# Altium project SingleChip-Rev2.PrjPcb (part 8 of 8)

## Sheet FAKRA connector.SchDoc: =ProjectTitle
size A3; Author: Jaime I. Chait; Organization: NWES LLC; Address1: 111 SW 5th Ave, STE 3150; Address2: Portland, OR 97204; DocumentNumber: SCH-0001; Revision: 2; SheetNumber: 17; SheetTotal: 19
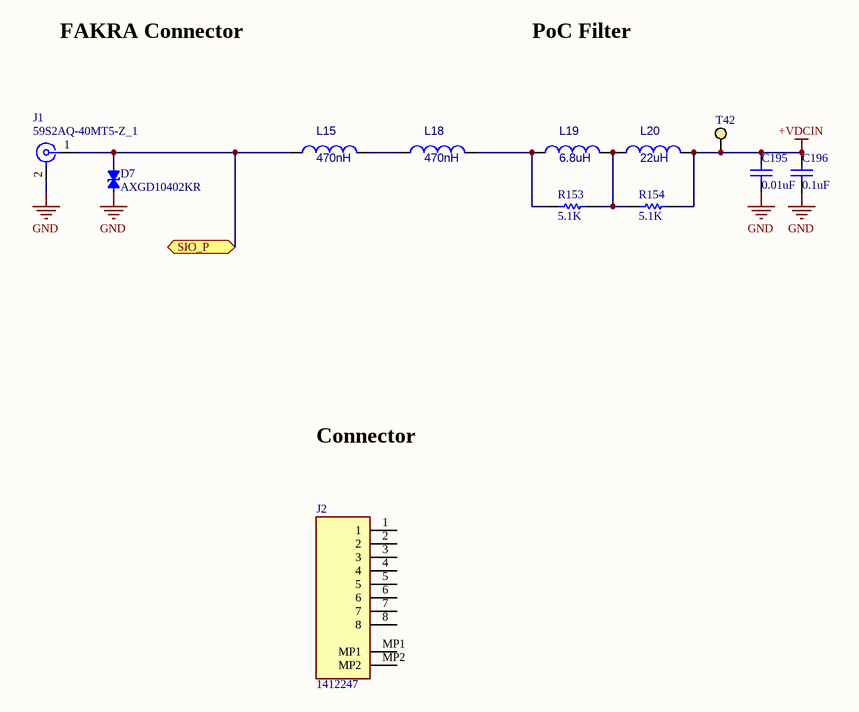
[diagram p19: FAKRA connector.SchDoc]

### Parts
C195  0.01uF  [CAPC1005X55USR]
C196  0.1uF  [CAPC1005X55USR]
D7  AXGD10402KR  [D_0402_1005Metric]
J1  59S2AQ-40MT5-Z_1  [Conn_FAKRA_59S2AQ-40MT5-Z_1]
J2  1412247  [CONN_Phoenix Contact_1412247]
L15  470nH  [PFL1609471MEW]
L18  470nH  [PFL1609471MEW]
L19  6.8uH  [IND_1210POC]
L20  22uH  [IND_MSS6132T]
R153  5.1K  [RESC1005X40USR]
R154  5.1K  [RESC1005X40USR]
T42  TP_S  [TP 1mm]  (value not drawn)  (no BOM)

### Ports
SIO_P (bidir)

### Nets
+VDCIN: C195.2 C196.1 L20.2 R154.2 T42.1
GND: C195.1 C196.2 D7.2(A) J1.2
NetC188_1: D7.1(C) J1.1 L15.1 ; port SIO_P
NetL15_2: L15.2 L18.1
NetL18_2: L18.2 L19.1 R153.1
NetL19_2: L19.2 L20.1 R153.2 R154.1

Not connected (* = marked no-connect by the designer): J1 3 4 5; J2 1 2 3 4 5 6 7 8 MP1 MP2

### Notes on the sheet
- FAKRA Connector
- PoC Filter
- Connector
- Title
- Size:
- Date:
- A4
- Number:
- Time:
- Revision:
- Sheet
- of
- File:

### Library data of the parts
C195 = CAP CER 0.01uF 50V X7R 0402: CAP CER 10000PF 50V X7R 0402; Manufacturer Part Number: GCM155R71H103KA55D; Manufacturer: Murata Electronics; Supplier Part Number 1: 490-4762-1-ND; Package: 0402; Height: 0.55mm; Supplier 1: Digi-Key; value: 0.01uF
C196 = CAP CER 0.1UF 25V X5R 0402: Manufacturer Part Number: CL05A104KA5NNNC; Manufacturer: Samsung Electro-Mechanics; Supplier Part Number 1: 1276-1043-1-ND; Package: 0402; Height: 0.55mm; Supplier 1: Digi-Key; value: 0.1uF
D7 = DIODE TVS 40VC 0402: ESD Suppressor Diode TVS Bi-Dir 24V Automotive 2-Pin Case 0402(1006Metric) T/R; Manufacturer: Littelfuse; Number of Bidirectional Channels: 1; Power Line Protection: No; Diode Type: ZENER; Supplier 1: Digikey; Supplier Part Number 1: F10019CT-ND; Manufacturer Part Number: AXGD10402KR; RoHS: Yes; Category: TVS Diodes; Stock: 44275; Pricing: 1=0.49, 10=0.356, 100=0.242, 500=0.19, 1000=0.152, 2000=0.146, 5000=0.14 (USD); Mounting Technology: Surface Mount; Case/Package: 0402; Case Code (Imperial): 0402; Case Code (Metric): 1005; Min Operating Temperature: -65°C; Max Operating Temperature: 125°C; Packaging: Cut Tape; Series: Automotive, AEC-Q200, XTREME-GUARD™; RoHS Compliant: Yes; ComponentLink1URL: https://media.digikey.com/pdf/Data%20Sheets/Littelfuse%20PDFs/AXGD1_Series.pdf?src-supplier=Digikey; ComponentLink1Description: https://media.digikey.com/pdf/Data%20Sheets/Littelfuse%20PDFs/AXGD1_Series.pdf?src-supplier=Digikey; ComponentLink2URL: https://datasheet.octopart.com/AXGD10402KR-Littelfuse-datasheet-102879905.pdf?src-supplier=Element14; ComponentLink2Description: https://datasheet.octopart.com/AXGD10402KR-Littelfuse-datasheet-102879905.pdf?src-supplier=Element14; ComponentLink3URL: https://datasheet.octopart.com/AXGD10402KR-Littelfuse-datasheet-170671804.pdf?src-supplier=Future+Electronics; ComponentLink3Description: https://datasheet.octopart.com/AXGD10402KR-Littelfuse-datasheet-170671804.pdf?src-supplier=Future+Electronics
J1 = Conn_FAKRA_59S2AQ-40MT5-Z_1: Right Angle Plug Pcb W/housin; Manufacturer: Rosenberger; Supplier 1: Mouser; Supplier Part Number 1: 476-59S2AQ-40MT5-Z_1; Manufacturer Part Number: 59S2AQ-40MT5-Z_1; RoHS: Yes; Category: RF / Coaxial Connectors; Stock: 5980; Pricing: 1=2.6, 10=2.37, 50=2.37, 100=2.09, 1000=1.5, 10000=1.35 (USD); RoHS Compliant: Yes
J2 = CONN_1412247: Circular connector; Insert; Female Sockets; 8 position; M8-8; 30V; Manufacturer: Phoenix Contact; Number of Positions: 8; Ratings: IP67,Waterproof,Dust Tight; Supplier 1: Digikey; Supplier Part Number 1: 277-10264-2-ND; Manufacturer Part Number: 1412247; RoHS: Yes; Category: Circular Connectors; Pricing: 100=9.09 (USD); Mounting Technology: Surface Mount; Pins: 8; Contact Material: Copper; Contact Finish - Mating: GOLD; Min Operating Temperature: -55°C; Max Operating Temperature: 105°C; Packaging: Cut Tape; Series: SACC; Termination: Solder; Voltage Rating (AC): 30V; Flammability Rating: UL94 V-0; ComponentLink1URL: https://media.digikey.com/pdf/Data%20Sheets/Phoenix%20Contact%20PDFs/1412247.pdf?src-supplier=Digikey; ComponentLink1Description: https://media.digikey.com/pdf/Data%20Sheets/Phoenix%20Contact%20PDFs/1412247.pdf?src-supplier=Digikey
L15 L18 = POWER INDUCTOR, SHIELDED, 20% TO: Power inductor, shielded, 20% tol, SMT, RoHS, halogen f; Manufacturer: Coilcraft; Manufacturer Part Number: PFL1609-471MEW; Core Material: Composite; Self Resonant Frequency: 650MHz; Max DC Current: 1.3A; Test Frequency: 7.9MHz; Supplier 1: Mouser; Supplier Part Number 1: 994-PFL1609-471MEW; RoHS: Yes; Category: Fixed Inductors; Stock: 2458; Pricing: 1=0.72, 10=0.72, 50=0.72, 100=0.7, 1000=0.536, 10000=0.515 (USD); Min Operating Temperature: -40°C; Max Operating Temperature: 85°C; Packaging: Tape and Reel; Tolerance: 20%; Shielding: Shielded; Value: 470nH; Termination: SMD/SMT; Series: PFL1609; Length: 1.8mm; Width: 1.07mm; Height: 0.95mm; Lead Free: Contains Lead; RoHS Compliant: Yes; ComponentLink1URL: http://www.mouser.com/ds/2/597/pfl1609-270712.pdf?src-supplier=Mouser; ComponentLink1Description: http://www.mouser.com/ds/2/597/pfl1609-270712.pdf?src-supplier=Mouser
L19 = Power Injection Chokes for PoC: Power Injection Chokes for PoC 6.8uH/1A; Manufacturer: Coilcraft; Manufacturer Part Number: 1210POC-682; RoHS: Yes; Category: Fixed Inductors; RoHS Compliant: Yes; Inductance: 6.8uH
L20 = FIXED IND 22UH 1.9A 158MOHM SM: Power Inductor, shielded, ferrite core, 20% tol, SMT, RoHS; Manufacturer: Coilcraft; Manufacturer Part Number: MSS6132T-223MLC; Supplier 1: Mouser; Supplier Part Number 1: 994-MSS6132T-223MLC; RoHS: Yes; Category: Fixed Inductors; Stock: 1738; Pricing: 1=2.13, 10=2.13, 50=2.13, 100=2.13, 1000=0.854, 10000=0.837 (USD); RoHS Compliant: Yes; ComponentLink1URL: https://datasheet.octopart.com/MSS6132T-223MLC-Coilcraft-datasheet-96966862.pdf?src-supplier=Coilcraft+Direct; ComponentLink1Description: https://datasheet.octopart.com/MSS6132T-223MLC-Coilcraft-datasheet-96966862.pdf?src-supplier=Coilcraft+Direct
R153 R154 = RES 5.1K OHM 1% 1/16W 0402: Manufacturer Part Number: RC0402FR-075K1L; Manufacturer: YAGEO; Supplier Part Number 1: 311-5.10KLRCT-ND; Supplier 1: Digi-Key; Height: 0.4mm; Package: 0402; value: 5.1K
T42 = Test point PAD: test point

## Nets that join several sheets
+0.6V_DDR_VREF: DDR4 (C22.2 U5.M1), Power-2 (C104.2 T18.1 U15.6)
+0.6V_DDR_VTT: DDR4 (38 pins), Power-2 (C102.1 T17.1 U15.3 U15.5)
+0.9V_MGTAVCC: FPGA Config_Power (7 pins), Power-2 (7 pins)
+1.2V_DDR: DDR4 (46 pins), Power-2 (9 pins)
+1.2V_MGTAVTT: FPGA Config_Power (17 pins), Power-2 (7 pins)
+1.8V_MGTAUX: FPGA Config_Power (C171.2 U3.R7 U3.U7), Power-2 (5 pins)
+1.8V_S1: Power-2 (17 pins), Serializer (C182.2 C183.2 C184.2 U4.11)
+1.8V_S2: FPGA-Camera-AWR (10 pins), FPGA Config_Power (27 pins), Power-1 (5 pins)
+2.5V_DDR: DDR4 (C90.2 C92.2 U5.B1 U5.R9), Power-2 (5 pins)
+3.3V: FPGA-Camera-AWR (5 pins), FPGA IO (22 pins), Power-1 (8 pins), Power-2 (15 pins), SFP_10GbE_Port0 (10 pins), Clock-Gen (7 pins), OX05B1S_CAM0 (9 pins), Serializer (13 pins), EVK External Connector (J5.40 R122.1)
+3.3VD: AWR2243_Decoupling_Caps (C5.1), AWR2243_DUT (11 pins), AWR2243_ExPWR_RST_LEDs (R74.2 R90.2 R189.2), AWR2243_LC_Filtering (R133.2)
+5V: AWR2243_ExPWR_RST_LEDs (R100.2 R103.2 R117.2), AWR2243_PMIC (11 pins), Power-1 (6 pins), Power-2 (C110.2 U17.2 U17.3), EVK External Connector (J5.2)
+VDCIN: Power-1 (33 pins), Power-2 (9 pins), FAKRA connector (5 pins)
AR_1P3_RF1: AWR2243_Decoupling_Caps (C45.1 C47.1), AWR2243_DUT (U2.G5 U2.H5 U2.J5), AWR2243_LC_Filtering (C36.2 C38.2 L5.2)
AR_1P3_RF2: AWR2243_Decoupling_Caps (C57.1 C58.1), AWR2243_DUT (U2.C2 U2.D2), AWR2243_LC_Filtering (C33.2 C34.2 L8.2 R137.1)
AR_1V2: AWR2243_Decoupling_Caps (C3.1 C4.1 C6.1 C7.1), AWR2243_DUT (6 pins), AWR2243_LC_Filtering (L9.2)
AR_1V4_APLL: AWR2243_Decoupling_Caps (C13.1), AWR2243_DUT (U2.A10)
AR_1V4_SYNTH: AWR2243_Decoupling_Caps (C14.1), AWR2243_DUT (U2.A13)
AR_1V8: AWR2243_Decoupling_Caps (7 pins), AWR2243_DUT (6 pins), AWR2243_LC_Filtering (C19.1 C91.2 L7.2)
AR_VBGAP: AWR2243_Decoupling_Caps (C56.1), AWR2243_DUT (U2.B10)
AR_VOUT_PA: AWR2243_Decoupling_Caps (C10.1 C65.1 C83.1), AWR2243_DUT (U2.A2 U2.B2), AWR2243_LC_Filtering (R137.2)
GND: AWR2243_Decoupling_Caps (22 pins), AWR2243_DUT (84 pins), AWR2243_ExPWR_RST_LEDs (7 pins), AWR2243_LC_Filtering (6 pins), AWR2243_PMIC (20 pins), DDR4 (50 pins), FPGA-Camera-AWR (19 pins), FPGA Config_Power (233 pins), FPGA IO (15 pins), Power-1 (73 pins), Power-2 (59 pins), SFP_10GbE_Port0 (15 pins), Clock-Gen (8 pins), OX05B1S_CAM0 (80 pins), Serializer (29 pins), EVK External Connector (J5.P1 J5.P2 J5.P3 J5.P4), FAKRA connector (C195.1 C196.2 D7.2 J1.2)
PMIC_1V0: AWR2243_LC_Filtering (L5.1 L8.1), AWR2243_PMIC (C81.2 L4.2 U8.1)
PMIC_1V2: AWR2243_LC_Filtering (L9.1), AWR2243_PMIC (C54.2 L1.2 U8.14)
PMIC_1V8: AWR2243_LC_Filtering (L7.1), AWR2243_PMIC (C82.2 L3.2 U8.21)
PMICOUT_3V3: AWR2243_LC_Filtering (R133.1), AWR2243_PMIC (C55.2 L2.2 R141.1 U8.8)
VCCINT: FPGA Config_Power (49 pins), Power-1 (12 pins)
VIO2: FPGA-Camera-AWR (5 pins), Power-2 (5 pins), EVK External Connector (J5.39)
+1.2V_DDR_PGOOD: Power-2 (R81.1 T19.1 U10.1 U15.7), Clock-Gen (Y2.1)
+1.2V_MGTAVTT_PGOOD: Power-2 (Q10.1 R109.1 T38.1 U19.9), Clock-Gen (Y3.1 Y4.1)
+1.8V_S2_PGOOD: Power-1 (R62.1 T6.1 U11.1), Power-2 (U6.3)
AR_GPIO_2: AWR2243_DUT (U2.N13), AWR2243_ExPWR_RST_LEDs (R110.2 R116.1)
AR_NERR_OUT: AWR2243_DUT (R91.1 U2.N8), AWR2243_ExPWR_RST_LEDs (DS1.2)
AR_NRST: AWR2243_DUT (J11.1 U2.P12), AWR2243_ExPWR_RST_LEDs (C11.2 R74.1 R160.1 SW2.4), FPGA IO (U3.E11)
AR_PMIC_CLKOUT_SOP2: AWR2243_DUT (R39.2 U2.P13), AWR2243_PMIC (R27.2), FPGA IO (U3.F10)
AR_SYNC_IN: AWR2243_DUT (R196.2 U2.N10), FPGA IO (U3.D9)
AR_SYNC_OUT_SOP1: AWR2243_DUT (R38.2 U2.P11), FPGA IO (U3.F9)
AR_WARMRST: AWR2243_DUT (R15.1 U2.N12), AWR2243_ExPWR_RST_LEDs (DS5.2)
CMOS_OSC_125MHz: FPGA IO (U3.G12), Clock-Gen (R179.2)
NetC188_1: Serializer (C188.1), FAKRA connector (D7.1 J1.1 L15.1)
PGOOD: AWR2243_PMIC (R138.2 R141.2), FPGA IO (U3.E10)
PMIC_CLK: AWR2243_PMIC (R26.1 R27.1), FPGA IO (U3.D11)
PMIC_EN1: AWR2243_PMIC (R142.1 U8.7), FPGA IO (U3.D10)
SFP_CTRL0_I2C_SCL: FPGA IO (R128.2 U3.D14), SFP_10GbE_Port0 (J8.5)
SFP_CTRL0_I2C_SDA: FPGA IO (R127.2 U3.E12), SFP_10GbE_Port0 (J8.4)
SFP_CTRL0_TX_DISABLE: FPGA IO (R129.1 U3.B12), SFP_10GbE_Port0 (Q11.1)
SY_GPIO_DIR: FPGA IO (U3.E13), EVK External Connector (J5.34)
VCCINT_PGOOD: Power-1 (R53.1 T4.1 U7.A5 U11.5), Power-2 (U16.6 U20.3)

## Assembly variants
BUILD: not fitted R32 R33 R36 R50 R58 R61 R63 R66 R67 R71 R80 R162 R162_1 R163 R163_1 R172 R172_1 R173 R173_1 R200 R204 R300 R304